# EAGLE design Encrypter (EAGLE 7.2.0)
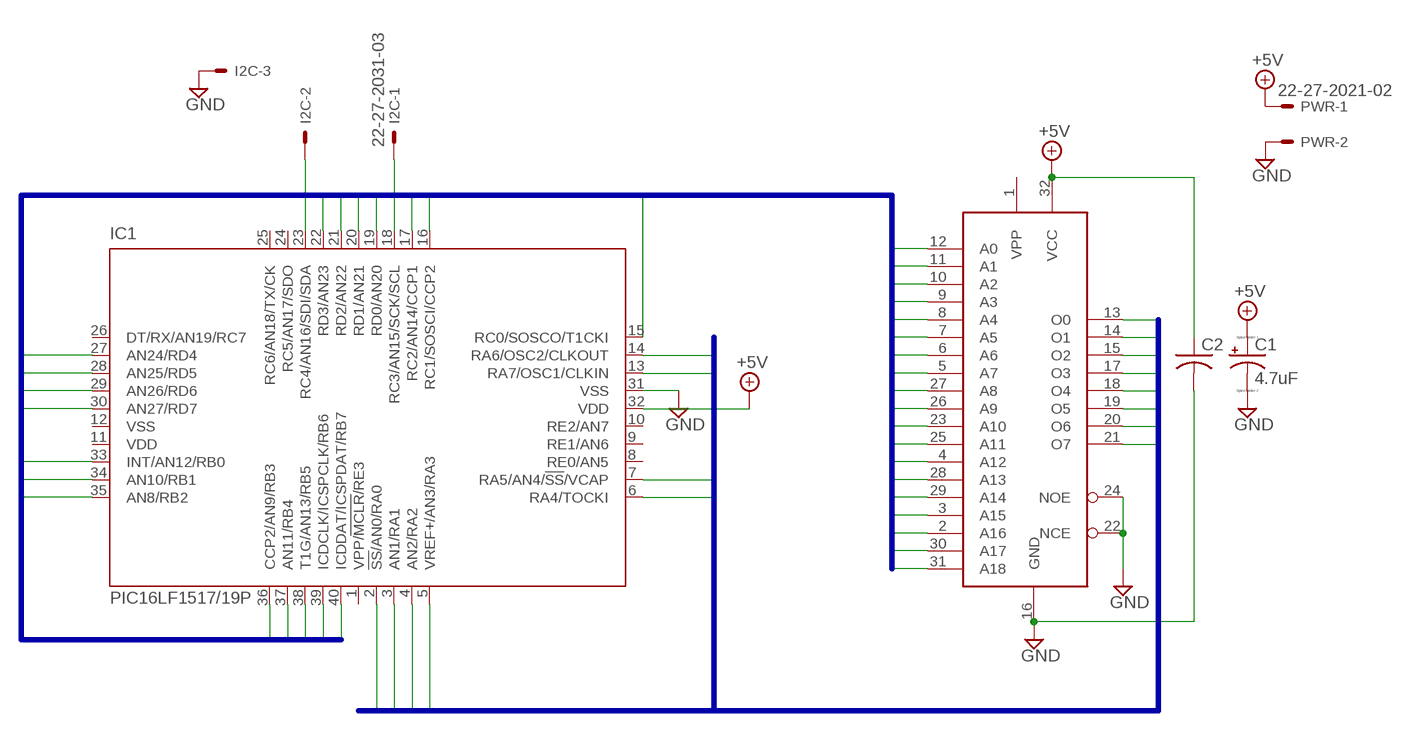
[diagram p0: schematic, sheet 1]

## Parts
C1  4.7uF  CPOL-USE3.5-10  [E3,5-10]
C2  C-US050-025X075  [C050-025X075]
I2C  22-27-2031-03  [6410-03]
IC1  PIC16LF1517/19P  [DIL40]
PWR  22-27-2021-02  [6410-02]
U$1  AT27C040  [DIL32]

## Nets
+5V: C1.+ C2.1 IC1.32(VDD) PWR.1 U$1.32(VCC)
A0: IC1.33(INT/AN12/RB0) U$1.12(A0)
A1: IC1.34(AN10/RB1) U$1.11(A1)
A2: IC1.35(AN8/RB2) U$1.10(A2)
A3: IC1.36(CCP2/AN9/RB3) U$1.9(A3)
A4: IC1.37(AN11/RB4) U$1.8(A4)
A5: IC1.38(T1G/AN13/RB5) U$1.7(A5)
A6: IC1.39(ICDCLK/ICSPCLK/RB6) U$1.6(A6)
A7: IC1.40(ICDDAT/ICSPDAT/RB7) U$1.5(A7)
A8: IC1.15(RC0/SOSCO/T1CKI) U$1.27(A8)
A9: IC1.16(RC1/SOSCI/CCP2) U$1.26(A9)
A10: IC1.17(RC2/AN14/CCP1) U$1.23(A10)
A11: IC1.19(RD0/AN20) U$1.25(A11)
A12: IC1.20(RD1/AN21) U$1.4(A12)
A13: IC1.21(RD2/AN22) U$1.28(A13)
A14: IC1.22(RD3/AN23) U$1.29(A14)
A15: IC1.27(AN24/RD4) U$1.3(A15)
A16: IC1.28(AN25/RD5) U$1.2(A16)
A17: IC1.29(AN26/RD6) U$1.30(A17)
A18: IC1.30(AN27/RD7) U$1.31(A18)
GND: C1.- C2.2 I2C.3 IC1.31(VSS) PWR.2 U$1.16(GND) U$1.22(NCE) U$1.24(NOE)
N$1: I2C.1 IC1.18(RC3/AN15/SCK/SCL)
N$2: I2C.2 IC1.23(RC4/AN16/SDI/SDA)
O0: IC1.2(!SS!/AN0/RA0) U$1.13(O0)
O1: IC1.3(AN1/RA1) U$1.14(O1)
O2: IC1.4(AN2/RA2) U$1.15(O2)
O3: IC1.5(VREF+/AN3/RA3) U$1.17(O3)
O4: IC1.6(RA4/TOCKI) U$1.18(O4)
O5: IC1.7(RA5/AN4/!SS!/VCAP) U$1.19(O5)
O6: IC1.14(RA6/OSC2/CLKOUT) U$1.20(O6)
O7: IC1.13(RA7/OSC1/CLKIN) U$1.21(O7)
Unconnected: IC1.1(VPP/!MCLR!/RE3) IC1.8(RE0/AN5) IC1.9(RE1/AN6) IC1.10(RE2/AN7) IC1.24(RC5/AN17/SDO) IC1.25(RC6/AN18/TX/CK) IC1.26(DT/RX/AN19/RC7) U$1.1(VPP)

## Buses
A0,A1,A2,A3,A4,A5,A6,A7,A8,A9,A10,A11,A12,A13,A14,A15,A16,A17,A18
O0,O1,O2,O3,O4,O5,O6,O7

## Power pins joined to a net without a drawn wire
VDD: IC1.11(VDD)
VSS: IC1.12(VSS)

## Library data of the parts
C1 = resistor:CPOL-US: POLARIZED CAPACITOR, American symbol
C2 = resistor:C-US: CAPACITOR, American symbol
I2C = con-molex:22-?-03: CONNECTOR wire to board 2.54 mm (.1 inch) pitch header; OC_FARNELL: unknown; OC_NEWARK: unknown
IC1 = microchip:PIC16*F1517/19: 28/40/44-Pin Flash Microcontrollers with nanoWatt XLP Technology PIC16F1517/1519 AND PIC16LF1517/1519 Source: www.microchip.com PIC16F1516.pdf
PWR = con-molex:22-?-02: CONNECTOR wire to board 2.54 mm (.1 inch) pitch header; OC_FARNELL: unknown; OC_NEWARK: unknown
U$1 = Football:AT27C040

## Board
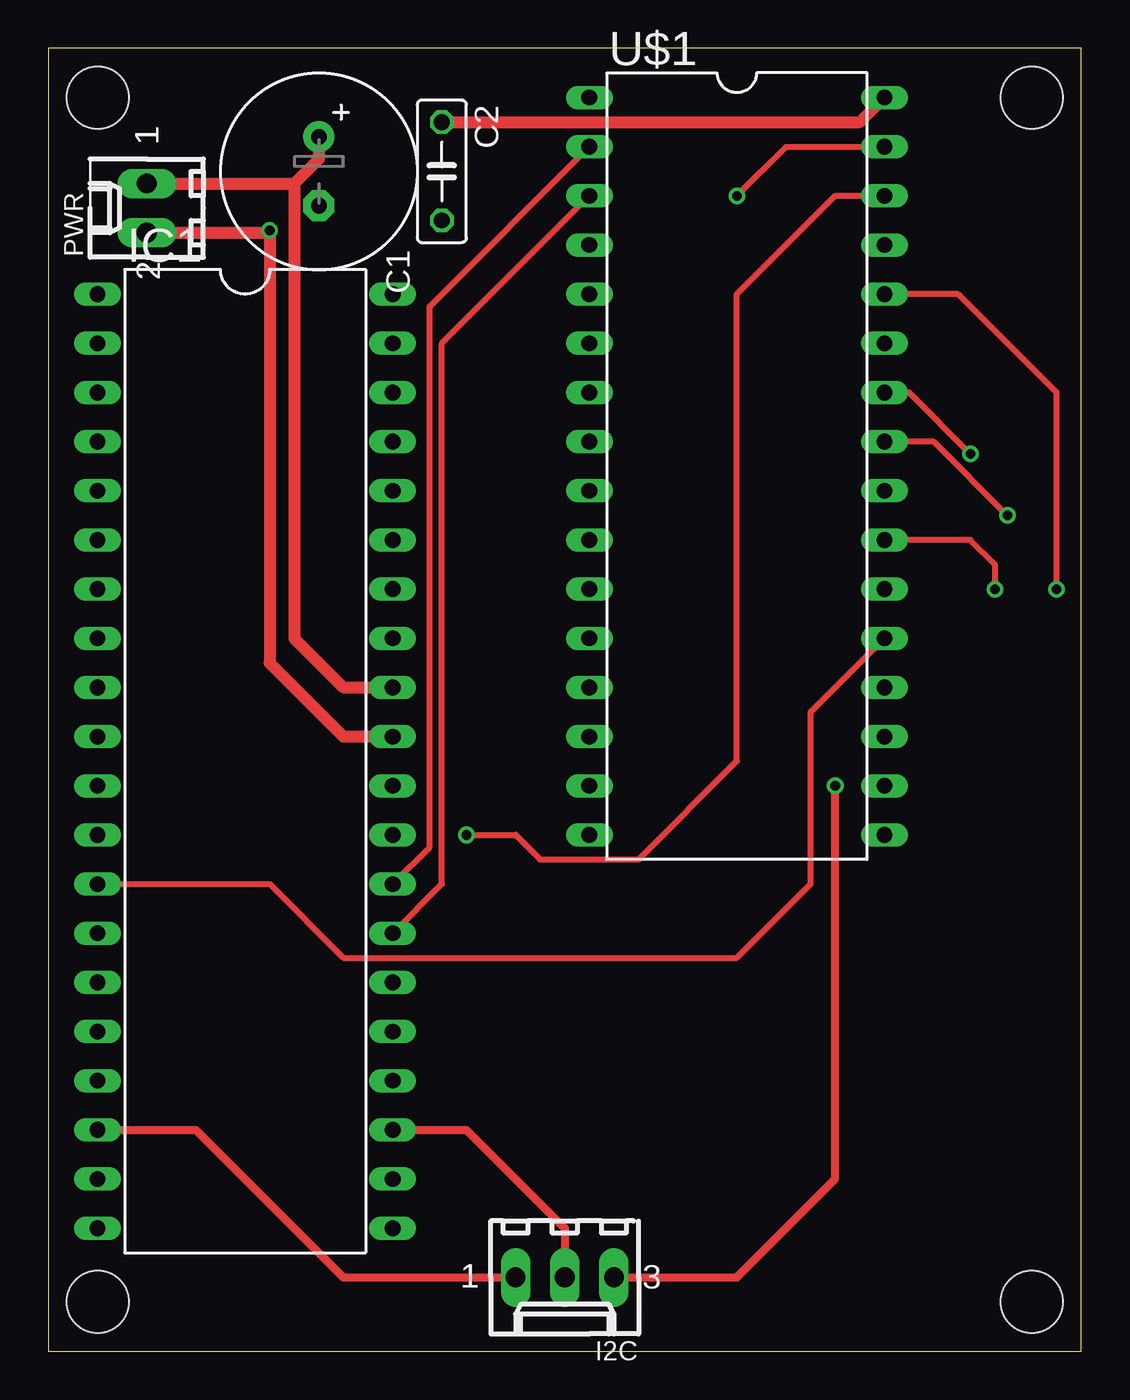
[diagram p1: board, top side]
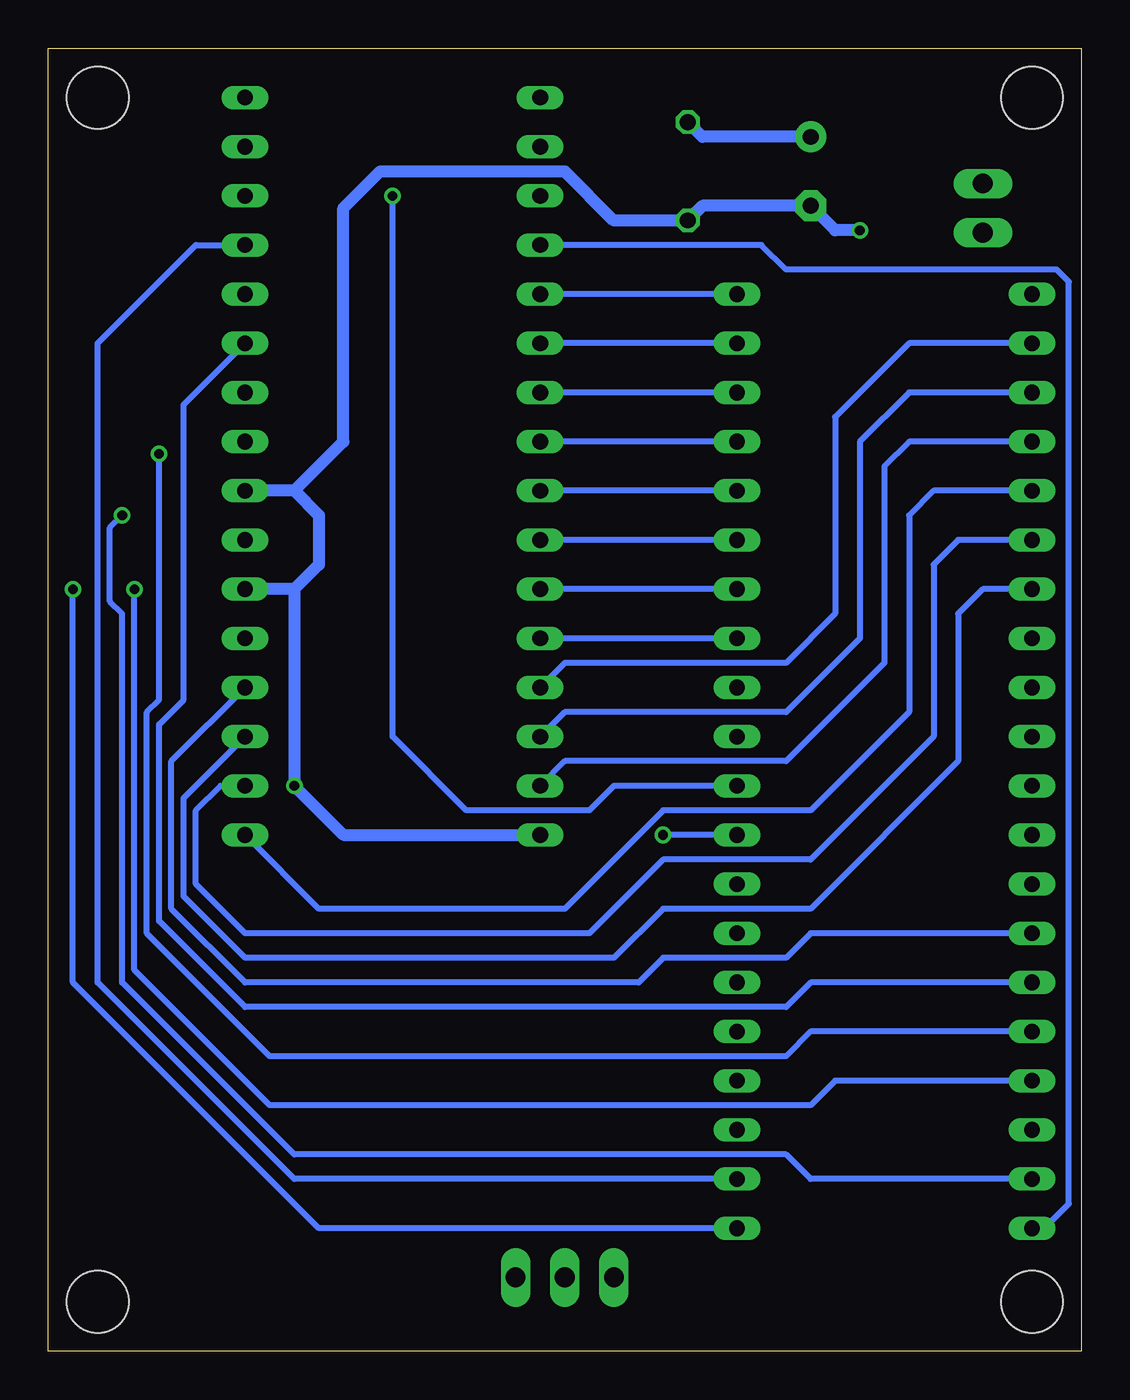
[diagram p2: board, bottom side, seen from below]

Size 53.34 x 67.31 mm. Coordinates in mm from the lower left corner, seen from the top.
Outline: 0,0 53.34,0 53.34,67.31 0,67.31 0,0
Copper layers (1*16): Top 0.0356mm / dielectric 1.5011mm / Bottom 0.0356mm
Design rules "Oshpark": minimum track width 6mil, minimum drill 13mil, track to track 6mil, track to pad 6mil, pad to pad 6mil, via to via 6mil, smd to smd 6mil, copper to edge 15mil, drill to drill 6mil, minimum pad ring 7mil, minimum via ring 7mil, stop-mask expansion 3mil, vias tented up to drill 0mil, thermal gap 10mil
Holes 3.2 mm at 50.8,64.77 2.54,64.77 2.54,2.54 50.8,2.54

### Footprints (pad centres in the part's own frame; a part is rotated, then mirrored left to right if it is on the bottom)
E3,5-10 = drill 0.813 pad 1.6: + -1.778,0 | drill 0.813 pad 1.6 octagon: - 1.778,0
C050-025X075 = drill 0.813 octagon: 1 -2.54,0; 2 2.54,0
6410-03 = drill 1.016 long: 1 2.54,0; 2 0,0; 3 -2.54,0
DIL40 = drill 0.813 long: 1 -24.13,-7.62; 2 -21.59,-7.62; 3 -19.05,-7.62; 4 -16.51,-7.62; 5 -13.97,-7.62; 6 -11.43,-7.62; 7 -8.89,-7.62; 8 -6.35,-7.62; 9 -3.81,-7.62; 10 -1.27,-7.62; 11 1.27,-7.62; 12 3.81,-7.62; 13 6.35,-7.62; 14 8.89,-7.62; 15 11.43,-7.62; 16 13.97,-7.62; 17 16.51,-7.62; 18 19.05,-7.62; 19 21.59,-7.62; 20 24.13,-7.62; 21 24.13,7.62; 22 21.59,7.62; 23 19.05,7.62; 24 16.51,7.62; 25 13.97,7.62; 26 11.43,7.62; 27 8.89,7.62; 28 6.35,7.62; 29 3.81,7.62; 30 1.27,7.62; 31 -1.27,7.62; 32 -3.81,7.62; 33 -6.35,7.62; 34 -8.89,7.62; 35 -11.43,7.62; 36 -13.97,7.62; 37 -16.51,7.62; 38 -19.05,7.62; 39 -21.59,7.62; 40 -24.13,7.62
6410-02 = drill 1.016 long: 1 1.27,0; 2 -1.27,0
DIL32 = drill 0.813 long: 1 -19.05,-7.62; 2 -16.51,-7.62; 3 -13.97,-7.62; 4 -11.43,-7.62; 5 -8.89,-7.62; 6 -6.35,-7.62; 7 -3.81,-7.62; 8 -1.27,-7.62; 9 1.27,-7.62; 10 3.81,-7.62; 11 6.35,-7.62; 12 8.89,-7.62; 13 11.43,-7.62; 14 13.97,-7.62; 15 16.51,-7.62; 16 19.05,-7.62; 17 19.05,7.62; 18 16.51,7.62; 19 13.97,7.62; 20 11.43,7.62; 21 8.89,7.62; 22 6.35,7.62; 23 3.81,7.62; 24 1.27,7.62; 25 -1.27,7.62; 26 -3.81,7.62; 27 -6.35,7.62; 28 -8.89,7.62; 29 -11.43,7.62; 30 -13.97,7.62; 31 -16.51,7.62; 32 -19.05,7.62

### Placement (x,y rotation side)
C1  13.97,60.96 270 top
C2  20.32,60.96 270 top
I2C  26.67,3.81 180 top
IC1  10.16,30.48 270 top
PWR  5.08,59.05 90 top
U$1  35.56,45.72 270 top

### Tracks (layer width: path | path; a pad name or v marks a point on that pad's centre or on a via)
+5V
  Top 0.61: 12.7,60.33 12.7,36.83 15.24,34.29 IC1.32 | C2.1 41.91,63.5 U$1.32 | PWR.1 12.7,60.33 | C1.+ 13.97,61.59 12.7,60.33
  Bottom 0.61: C1.+ 19.56,62.74 C2.1
A0
  Bottom 0.305: IC1.33 U$1.12
A1
  Bottom 0.305: IC1.34 U$1.11
A2
  Bottom 0.305: IC1.35 U$1.10
A3
  Bottom 0.305: IC1.36 U$1.9
A4
  Bottom 0.305: IC1.37 U$1.8
A5
  Bottom 0.305: IC1.38 U$1.7
A6
  Bottom 0.305: IC1.39 U$1.6
A7
  Bottom 0.305: IC1.40 U$1.5
A8
  Bottom 0.305: IC1.15 13.97,19.05 15.24,17.78 43.18,17.78 47.62,22.22 47.62,32.38 46.35,33.66 46.35,48.9 U$1.27
A9  (via drill 0.5)
  Top 0.305: v47.62,46.36 44.45,49.53 U$1.26
  Bottom 0.305: IC1.16 13.97,16.51 15.24,15.24 41.91,15.24 48.26,21.59 48.26,33.02 47.62,33.66 v47.62,46.36
A10  (via drill 0.5)
  Top 0.305: v48.9,39.37 48.9,40.64 47.62,41.91 U$1.23
  Bottom 0.305: IC1.17 12.7,13.97 13.97,12.7 41.91,12.7 48.9,19.68 v48.9,39.37
A11  (via drill 0.5)
  Top 0.305: v49.53,43.18 45.72,46.99 U$1.25
  Bottom 0.305: IC1.19 13.97,8.89 15.24,10.16 40.64,10.16 49.53,19.05 49.53,38.1 50.16,38.73 50.16,42.55 v49.53,43.18
A12
  Bottom 0.305: IC1.20 1.91,6.35 0.64,7.62 0.64,55.25 1.27,55.88 15.24,55.88 16.51,57.15 U$1.4
A13  (via drill 0.5)
  Top 0.305: v52.07,39.37 52.07,49.53 46.99,54.61 U$1.28
  Bottom 0.305: IC1.21 39.37,6.35 52.07,19.05 v52.07,39.37
A14
  Bottom 0.305: IC1.22 40.64,8.89 50.8,19.05 50.8,52.07 45.72,57.15 U$1.29
A15
  Top 0.305: IC1.27 20.32,24.13 20.32,52.07 U$1.3
A16
  Top 0.305: IC1.28 19.68,26.04 19.68,53.98 U$1.2
A17  (via drill 0.5)
  Top 0.305: v21.59,26.67 24.13,26.67 25.4,25.4 30.48,25.4 35.56,30.48 35.56,54.61 40.64,59.69 U$1.30
  Bottom 0.305: IC1.29 v21.59,26.67
A18  (via drill 0.5)
  Top 0.305: v35.56,59.69 38.1,62.23 U$1.31
  Bottom 0.305: IC1.30 24.13,29.21 25.4,27.94 31.75,27.94 35.56,31.75 v35.56,59.69
GND  (via drill 0.5)
  Top 0.406: I2C.3 35.56,3.81 40.64,8.89 v40.64,29.21
  Top 0.61: v11.43,57.91 11.43,57.79 | 11.43,57.79 11.43,35.56 15.24,31.75 IC1.31 | PWR.2 11.43,57.79
  Bottom 0.61: 40.64,44.45 U$1.24 | 40.64,44.45 38.1,46.99 38.1,59.05 36.2,60.96 26.67,60.96 24.13,58.42 C2.2 19.56,59.18 C1.- 12.7,57.91 v11.43,57.91 | 40.64,44.45 39.37,43.18 39.37,40.64 40.64,39.37 | 40.64,39.37 U$1.22 | 40.64,39.37 v40.64,29.21 38.1,26.67 U$1.16
N$1
  Top 0.406: IC1.18 7.62,11.43 15.24,3.81 I2C.1
N$2
  Top 0.406: IC1.23 21.59,11.43 26.67,6.35 I2C.2
O0
  Bottom 0.305: IC1.2 8.89,52.07 12.7,48.26 12.7,38.1 15.24,35.56 26.67,35.56 U$1.13
O1
  Bottom 0.305: IC1.3 8.89,49.53 11.43,46.99 11.43,36.83 15.24,33.02 26.67,33.02 U$1.14
O2
  Bottom 0.305: IC1.4 8.89,46.99 10.16,45.72 10.16,35.56 15.24,30.48 26.67,30.48 U$1.15
O3
  Bottom 0.305: IC1.5 7.62,44.45 8.89,43.18 8.89,33.02 13.97,27.94 21.59,27.94 26.67,22.86 39.37,22.86 U$1.17
O4
  Bottom 0.305: IC1.6 6.35,41.91 7.62,40.64 7.62,31.75 13.97,25.4 21.59,25.4 25.4,21.59 43.18,21.59 45.72,24.13 45.72,27.94 44.45,29.21 U$1.18
O5
  Bottom 0.305: IC1.7 5.08,39.37 6.35,38.1 6.35,30.48 13.97,22.86 21.59,22.86 24.13,20.32 43.18,20.32 46.35,23.49 46.35,28.57 U$1.19
O6
  Bottom 0.305: IC1.14 13.97,21.59 15.24,20.32 21.59,20.32 22.86,19.05 43.18,19.05 46.99,22.86 46.99,30.48 U$1.20
O7
  Top 0.305: IC1.13 11.43,24.13 15.24,20.32 35.56,20.32 39.37,24.13 39.37,33.02 U$1.21